# EAGLE design 12-5Convertor (EAGLE 7.2.0)
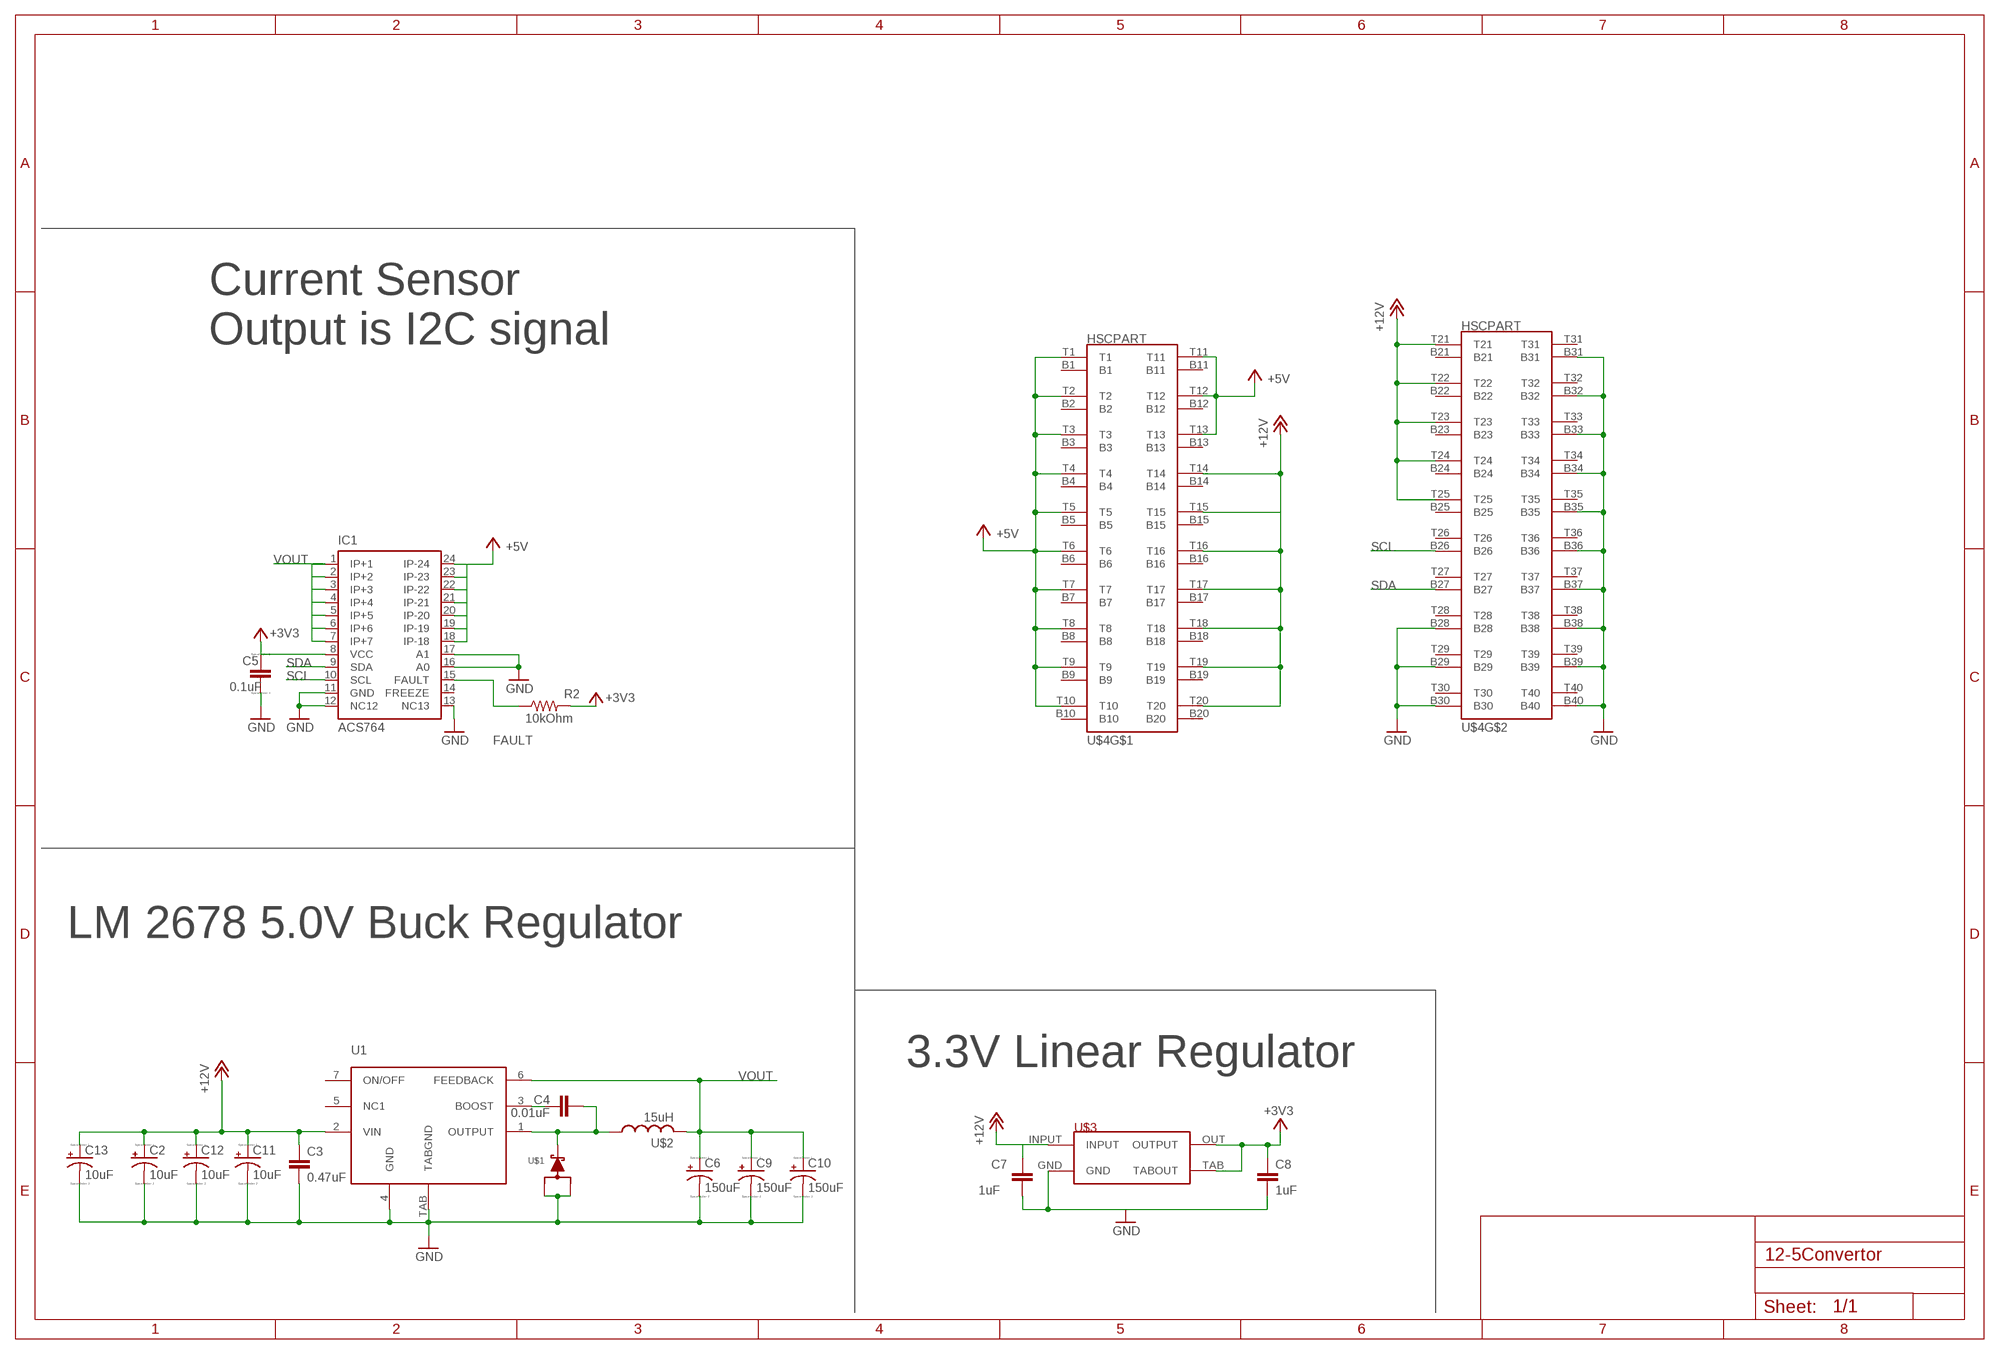
[diagram p0: schematic, sheet 1]

## Parts
C2  10uF  C-TANTALUM(10UF_150UF)  [CTAN(7.30_4.30MM)]
C3  0.47uF  CAP0805  [0805]
C4  0.01uF  CAP0603-CAP  [0603-CAP]
C5  0.1uF  CC0603  [C0603]
C6  150uF  C-TANTALUM(10UF_150UF)  [CTAN(7.30_4.30MM)]
C7  1uF  CAP0603-CAP  [0603-CAP]
C8  1uF  CAP0603-CAP  [0603-CAP]
C9  150uF  C-TANTALUM(10UF_150UF)  [CTAN(7.30_4.30MM)]
C10  150uF  C-TANTALUM(10UF_150UF)  [CTAN(7.30_4.30MM)]
C11  10uF  C-TANTALUM(10UF_150UF)  [CTAN(7.30_4.30MM)]
C12  10uF  C-TANTALUM(10UF_150UF)  [CTAN(7.30_4.30MM)]
C13  10uF  C-TANTALUM(10UF_150UF)  [CTAN(7.30_4.30MM)]
IC1  ACS764  [SSOP24]
R2  10kOhm  R-US_R0603  [R0603]
U1  LM2678  [LM2678]
U$1  SWITCHMODE_SCHOTTKY  [DPAK-3]
U$2  15uH  HCMA1305  [HCMA1305]
U$3  NCP1117  [NCP1117]
U$4  HSCPART  [HSC8-40PINOUUT]

## Nets
+3V3: C5.1 C8.1 IC1.8(VCC) R2.2 U$3.OUT(OUTPUT) U$3.TAB(TABOUT)
+5V: IC1.18(IP-18) IC1.19(IP-19) IC1.20(IP-20) IC1.21(IP-21) IC1.22(IP-22) IC1.23(IP-23) IC1.24(IP-24) U$4.T1 U$4.T2 U$4.T3 U$4.T4 U$4.T5 U$4.T6 U$4.T7 U$4.T8 U$4.T9 U$4.T10 U$4.T11 U$4.T12 U$4.T13
+12V: C2.+ C3.1 C7.1 C11.+ C12.+ C13.+ U1.2(VIN) U$3.INPUT U$4.T14 U$4.T15 U$4.T16 U$4.T17 U$4.T18 U$4.T19 U$4.T20 U$4.T21 U$4.T22 U$4.T23 U$4.T24 U$4.T25
FAULT: IC1.15(FAULT) R2.1
GND: C2.- C3.2 C5.2 C6.- C7.2 C8.2 C9.- C10.- C11.- C12.- C13.- IC1.11(GND) IC1.12(NC12) IC1.13(NC13) IC1.16(A0) IC1.17(A1) U1.4(GND) U1.TAB(TABGND) U$1.P$1 U$1.P$3 U$3.GND U$4.B28 U$4.B29 U$4.B30 U$4.B31 U$4.B32 U$4.B33 U$4.B34 U$4.B35 U$4.B36 U$4.B37 U$4.B38 U$4.B39 U$4.B40
N$2: C4.1 U1.3(BOOST)
N$3: C4.2 U1.1(OUTPUT) U$1.P$4 U$2.P$1
SCL: IC1.10(SCL) U$4.B26
SDA: IC1.9(SDA) U$4.B27
VOUT: C6.+ C9.+ C10.+ IC1.1(IP+1) IC1.2(IP+2) IC1.3(IP+3) IC1.4(IP+4) IC1.5(IP+5) IC1.6(IP+6) IC1.7(IP+7) U1.6(FEEDBACK) U$2.P$2
Unconnected: IC1.14(FREEZE) U1.5(NC1) U1.7(ON/OFF) U$4.B1 U$4.B2 U$4.B3 U$4.B4 U$4.B5 U$4.B6 U$4.B7 U$4.B8 U$4.B9 U$4.B10 U$4.B11 U$4.B12 U$4.B13 U$4.B14 U$4.B15 U$4.B16 U$4.B17 U$4.B18 U$4.B19 U$4.B20 U$4.B21 U$4.B22 U$4.B23 U$4.B24 U$4.B25 U$4.T26 U$4.T27 U$4.T28 U$4.T29 U$4.T30 U$4.T31 U$4.T32 U$4.T33 U$4.T34 U$4.T35 U$4.T36 U$4.T37 U$4.T38 U$4.T39 U$4.T40

## Notes on the sheet
- Current Sensor
  Output is I2C signal
- LM 2678 5.0V Buck Regulator
- 3.3V Linear Regulator

## Library data of the parts
C2 C6 C9-C13 = PowerComponents:C-TANTALUM(10UF_150UF)
C3 = SparkFun-Capacitors:CAP: Capacitor Standard 0603 ceramic capacitor, and 0.1" leaded capacitor.
C4 C7 C8 = SparkFun-Passives:CAP: Capacitor Standard 0603 ceramic capacitor, and 0.1" leaded capacitor.
C5 = eagle-ltspice:C: CAPACITOR, European symbol; SPICEMODEL: NONE; SPICEPREFIX: C
IC1 = ACS764:ACS764: 8-bit Microcontroller with Multiprotocol Smart Card Interface Source: Uploaded by Heiko Künzel <heiko.kuenzel@atg-gera.de> from ATG Automatisierungstechnik Gera Mon Mar 10 13:32:48 2003 Atmel-Library mit zusätzlich T83C5121-Prozessor im SSOP24-Package.; OC_FARNELL: unknown; OC_NEWARK: unknown
R2 = DiscreteComponents:R-US_: RESISTOR, American symbol
U1 = PowerComponents:LM2678: LM2678 Buck Converter IC 12V-to-5V
U$1 = PowerComponents:SWITCHMODE_SCHOTTKY: {Digi-Key Part Number: MBRD835LT4GOSCT-ND} {Voltage - DC Reverse (Vr) (Max): 35V} {Current - Average Rectified (Io): 8A} {Voltage - Forward (Vf) (Max) @ If: 510mV @ 8A} {Speed: Fast Recovery =< 500ns, > 200mA (Io)} {Current - Reverse Leakage @ Vr: 1.4mA @ 35V} {Mounting Type: Surface Mount} {Package / Case: TO-252-3, DPak (2 Leads + Tab), SC-63} {Supplier Device Package: DPAK-3} {Operating Temperature - Junction: -65°C ~ 150°C}
U$2 = DiscreteComponents:HCMA1305
U$3 = PowerComponents:NCP1117
U$4 = Connectors:HSCPART

## Board
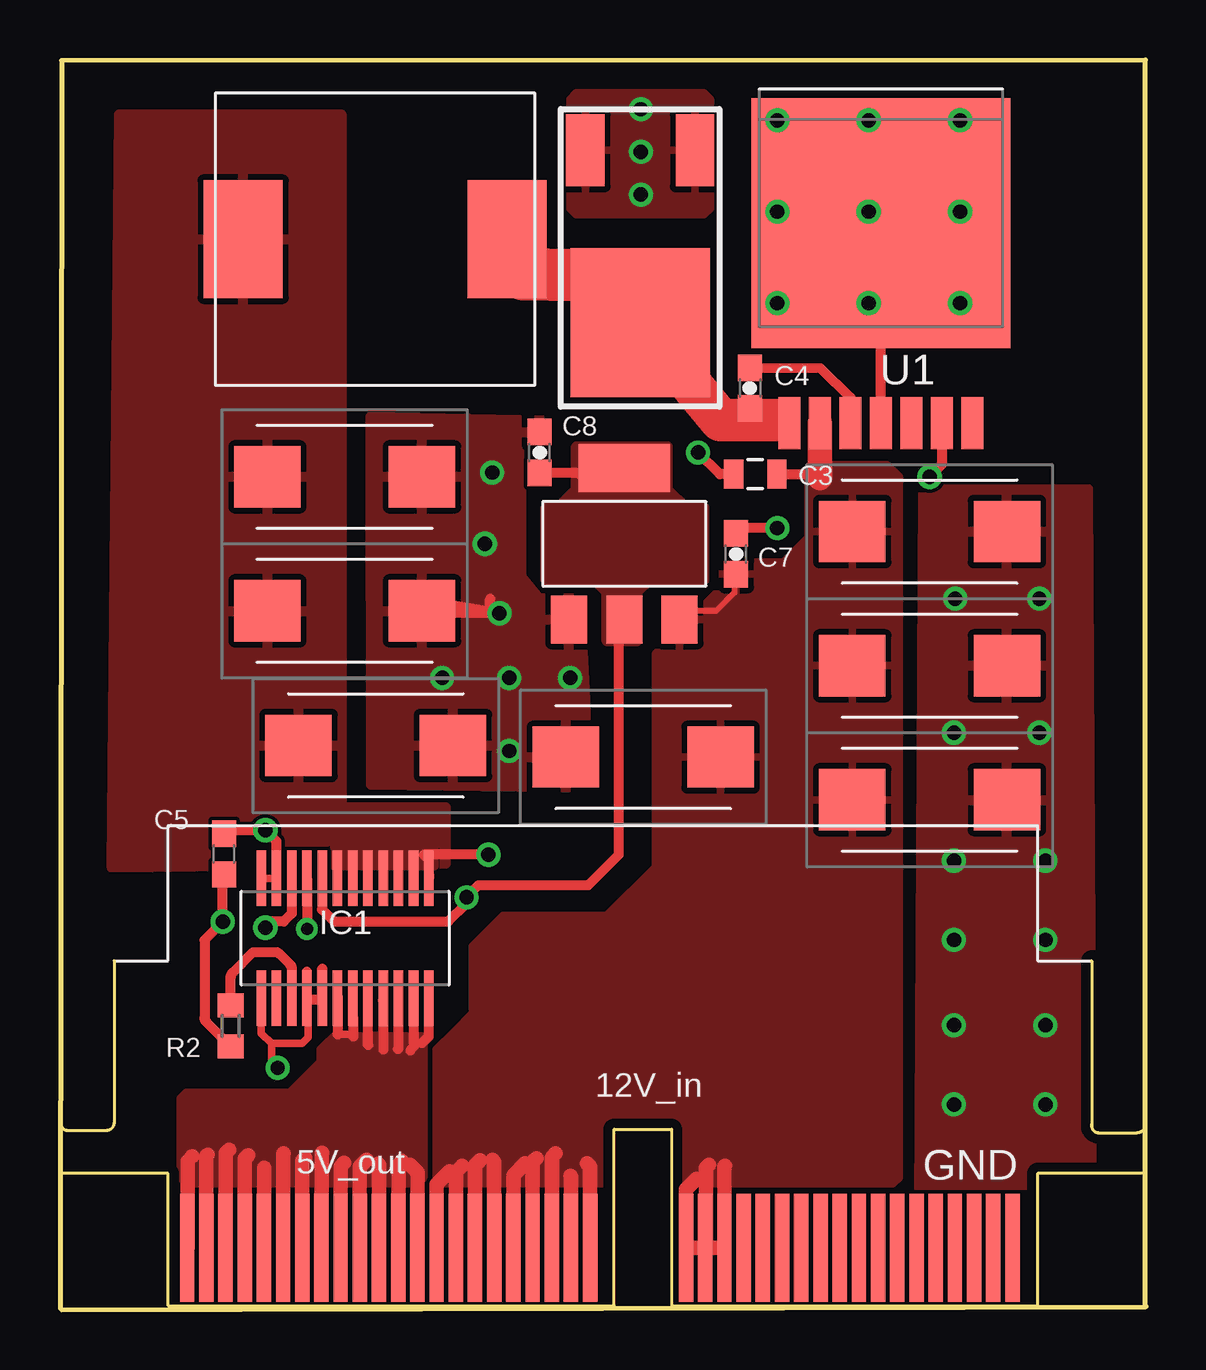
[diagram p1: board, top side]
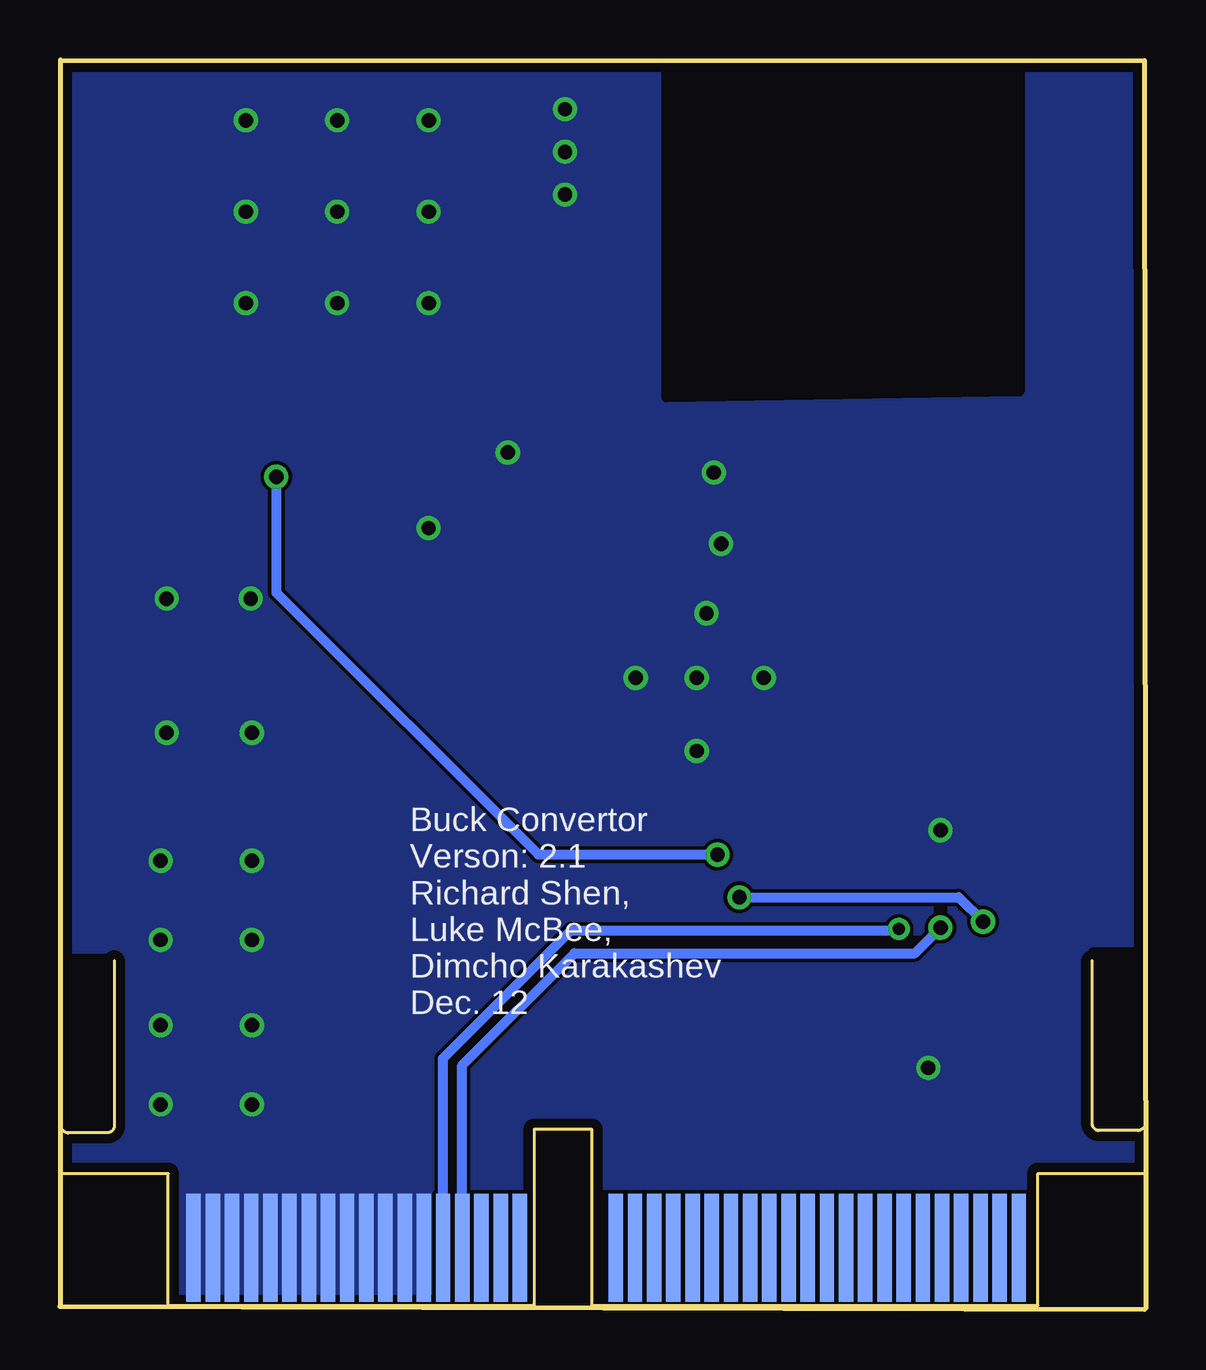
[diagram p2: board, bottom side, seen from below]

Size 45.27 x 52.09 mm. Coordinates in mm from the lower left corner, seen from the top.
Outline: 45.24,0.17 45.24,52.09 0.07,52.06 0.01,0.04
Outline: 0.05,0 45.27,0.13
Copper layers (1*16): Top 0.035559375mm / dielectric 1.501140625mm / Bottom 0.035559375mm
Design rules "typical_4pcb": minimum track width 10mil, minimum drill 15mil, track to track 6mil, track to pad 6mil, pad to pad 6mil, via to via 6mil, smd to smd 6mil, copper to edge 15mil, drill to drill 8mil, minimum pad ring 10mil, minimum via ring 8mil, stop-mask expansion 4mil, vias tented up to drill 0mil, thermal gap 10mil

### Footprints (pad centres in the part's own frame; a part is rotated, then mirrored left to right if it is on the bottom)
CTAN(7.30_4.30MM) = smd 2.77 x 2.55: + -3.22,0; - 3.22,0
0805 = smd 0.8 x 1.2: 1 -0.9,0; 2 0.9,0
0603-CAP = smd 1.1 x 1: 1 -0.85,0; 2 0.85,0
C0603 = smd 1.1 x 1: 1 -0.85,0; 2 0.85,0
SSOP24 = smd 0.4 x 2.3: 1 -3.51,-2.47; 2 -2.875,-2.47; 3 -2.24,-2.47; 4 -1.605,-2.47; 5 -0.97,-2.47; 6 -0.335,-2.47; 7 0.3,-2.47; 8 0.935,-2.47; 9 1.57,-2.47; 10 2.205,-2.47; 11 2.84,-2.47; 12 3.475,-2.47; 13 3.475,2.53; 14 2.84,2.53; 15 2.205,2.53; 16 1.57,2.53; 17 0.935,2.53; 18 0.3,2.53; 19 -0.335,2.53; 20 -0.97,2.53; 21 -1.605,2.53; 22 -2.24,2.53; 23 -2.875,2.53; 24 -3.51,2.53
R0603 = smd 1 x 1.1: 1 -0.85,0; 2 0.85,0
LM2678 = smd 2.159 x 0.914: 1 8.331,-3.81; 2 8.331,-2.54; 3 8.331,-1.27; 4 8.331,0; 5 8.331,1.27; 6 8.331,2.54; 7 8.331,3.81 | smd 10.414 x 10.795: TAB 0,0
DPAK-3 = smd 3 x 1.6: P$1 4.08,-2.285; P$3 4.08,2.285 | smd 6.2 x 5.8: P$4 -3.1,0
HCMA1305 = smd 4.9 x 3.3: P$1 0,5.5; P$2 0,-5.5
NCP1117 = smd 1.5 x 2: GND -2.3,-3.15; INPUT 2.3,-3.15; OUT 0,-3.15 | smd 3.8 x 2: TAB 0,3.15
HSC8-40PINOUUT = smd 0.6 x 4.5 bottom: B1 0.8,2.4; B2 1.6,2.4; B3 2.4,2.4; B4 3.2,2.4; B5 4,2.4; B6 4.8,2.4; B7 5.6,2.4; B8 6.4,2.4; B9 7.2,2.4; B10 8,2.4; B11 8.8,2.4; B12 9.6,2.4; B13 10.4,2.4; B14 11.2,2.4; B15 12,2.4; B16 12.8,2.4; B17 13.6,2.4; B18 14.4,2.4; B19 15.2,2.4; B20 16,2.4; B21 16.8,2.4; B22 17.6,2.4; B23 21.6,2.4; B24 22.4,2.4; B25 23.2,2.4; B26 24,2.4; B27 24.8,2.4; B28 25.6,2.4; B29 26.4,2.4; B30 27.2,2.4; B31 28,2.4; B32 28.8,2.4; B33 29.6,2.4; B34 30.4,2.4; B35 31.2,2.4; B36 32,2.4; B37 32.8,2.4; B38 33.6,2.4; B39 34.4,2.4; B40 35.2,2.4 | smd 0.6 x 4.5: T1 0.8,2.4; T2 1.6,2.4; T3 2.4,2.4; T4 3.2,2.4; T5 4,2.4; T6 4.8,2.4; T7 5.6,2.4; T8 6.4,2.4; T9 7.2,2.4; T10 8,2.4; T11 8.8,2.4; T12 9.6,2.4; T13 10.4,2.4; T14 11.2,2.4; T15 12,2.4; T16 12.8,2.4; T17 13.6,2.4; T18 14.4,2.4; T19 15.2,2.4; T20 16,2.4; T21 16.8,2.4; T22 17.6,2.4; T23 21.6,2.4; T24 22.4,2.4; T25 23.2,2.4; T26 24,2.4; T27 24.8,2.4; T28 25.6,2.4; T29 26.4,2.4; T30 27.2,2.4; T31 28,2.4; T32 28.8,2.4; T33 29.6,2.4; T34 30.4,2.4; T35 31.2,2.4; T36 32,2.4; T37 32.8,2.4; T38 33.6,2.4; T39 34.4,2.4; T40 35.2,2.4

### Placement (x,y rotation side)
C2  24.31,23.03 180 top
C3  28.99,34.82 180 top
C4  28.76,38.41 270 top
C5  6.84,18.99 90 top
C6  11.87,34.71 0 top
C7  28.18,31.5 90 top
C8  19.99,35.73 90 top
C9  11.87,29.12 0 top
C10  13.16,23.51 0 top
C11  36.25,32.43 0 top
C12  36.25,26.84 0 top
C13  36.25,21.25 0 top
IC1  11.87,15.51 180 top
R2  7.12,11.83 270 top
U1  34.22,45.28 270 top
U$1  24.18,44.24 90 top
U$2  13.14,44.62 270 top
U$3  23.52,31.92 0 top
U$4  4.5,0.17 0 top

### Tracks (layer width: path | path; a pad name or v marks a point on that pad's centre or on a via)
+3V3  (via drill 0.6)
  Top 0.406: R2.2 6.1,11.99 arc-45 6.02,12.17 6.02,15.41 v6.79,16.17 6.79,18.14 C5.1 | IC1.8 10.93,16.68 11.43,16.17 16.18,16.17 16.95,16.93 v16.95,17.19 17.45,17.69 22.03,17.69 23.3,18.96 23.3,28.54 | C8.1 21.61,34.88 22.03,34.46 22.92,34.46 U$3.TAB
  Bottom 0.406: v16.95,17.19 7.8,17.19 v6.79,16.17
  pour Top (no thermals): 22.79,27.85 22.79,29.89 22.28,30.39 20.25,30.39 20.25,33.44 20.76,33.44 21.52,34.2 21.52,35.98 25.33,35.98 25.33,34.2 26.09,33.44 26.85,33.44 26.85,30.39 24.57,30.39 24.06,29.89 24.06,27.85
+5V
  Top 0.305: 5.31,2.57 U$4.T1 | U$4.T2 | U$4.T3 | U$4.T4 | U$4.T5 | U$4.T5 | U$4.T6 | U$4.T7 | 10.92,2.56 10.9,2.55 U$4.T8 | U$4.T9 | U$4.T9 | U$4.T10 | 13.31,2.55 13.3,2.55 U$4.T11 | U$4.T12 | 14.9,2.45 U$4.T13 | 11.57,13.05 IC1.18 | 12.2,13.03 IC1.19 | IC1.20 | IC1.21 13.48,12.98 13.47,12.87 | IC1.22 | IC1.23 14.74,12.97 IC1.23 | IC1.24 15.37,12.87 | 11.57,11.47 12.2,11.47 12.21,11.4
  Top 0.406: 11.57,13.05 11.57,11.47 11.58,11.46 | 12.2,13.03 12.21,11.4 12.22,11.38 | IC1.20 12.83,11.05 12.86,11.03 | IC1.21 13.47,12.87 13.47,10.84 13.49,10.84 | IC1.22 14.1,10.88 14.08,10.85 | IC1.23 14.75,10.96 14.6,10.8 | IC1.24 15.37,12.87 15.37,11.39 15.08,11.1
  Top 0.61: 5.31,2.57 5.31,6.18 5.51,6.38 | U$4.T2 6.1,6.38 6.17,6.44 | U$4.T3 6.9,6.5 7.05,6.65 | U$4.T4 7.7,6.28 7.85,6.42 | U$4.T5 8.5,5.9 8.52,5.92 | U$4.T6 9.3,6.49 9.33,6.52 | U$4.T7 10.1,6.2 10.21,6.32 | 10.92,2.56 10.9,6.49 10.94,6.53 | U$4.T9 11.7,5.96 11.85,6.11 | U$4.T10 12.5,5.96 12.78,6.24 | 13.31,2.55 13.31,6.04 13.27,6.08 | U$4.T12 14.1,6.04 14.24,6.2 | 14.9,2.45 14.9,5.72 14.6,6.03
  pour Top: 11.61,11.6 15.42,11.6 15.42,11.34 15.17,11.09 15.17,5.5 14.91,5.25 5.26,5.25 5.01,5.5 5.01,8.8 5.26,9.06 9.58,9.06 10.85,10.33 10.85,10.84
+12V
  Top 0.254: 28.12,30.59 28.12,29.89 27.36,29.12 26.18,29.12 U$3.INPUT
  Top 0.305: U$4.T14 | 16.51,2.55 16.5,2.55 U$4.T15 | 17.3,2.54 U$4.T16 | 18.09,2.56 18.1,2.56 U$4.T17 | U$4.T18 | 19.7,2.55 U$4.T19 | 20.5,2.55 U$4.T20 | U$4.T21 | U$4.T22 22.1,2.56 U$4.T22 | 26.92,2.56 26.9,2.56 U$4.T24 | U$4.T25 27.61,2.57 27.61,2.56 | 27.7,2.56 27.61,2.56 | 27.61,2.56 27.61,2.45
  Top 0.406: C3.1 31.64,34.82 31.68,34.86 | 25.98,28.62 U$3.INPUT | 28.12,30.59 C7.1
  Top 0.61: U$4.T23 U$4.T24 U$4.T25 | U$4.T14 15.7,5.23 16.24,5.76 | 16.51,2.55 16.51,5.73 16.77,5.99 | U$4.T18 18.9,5.6 19.38,6.09 | 17.3,2.54 17.3,6.01 17.51,6.22 | 20.5,2.55 20.5,6.34 20.66,6.51 | 18.09,2.56 18.09,6.16 18.04,6.24 | 19.7,2.55 19.7,6.15 19.86,6.3 | U$4.T21 21.3,5.56 21.28,5.58 | U$4.T22 22.1,5.97 21.97,6.1 | 26.1,2.56 26.1,5.01 26.52,5.44 | 26.92,2.56 26.92,5.91 27.05,6.04 | 27.7,2.56 27.7,5.98 27.71,5.99
  Top 1.016: U1.2 31.68,34.86 31.68,34.66
  pour Top: 31.42,35.22 34.47,35.22 34.98,34.71 34.98,5.5 34.73,5.25 15.93,5.25 15.68,5.5 15.68,10.84 16.44,11.6 17.2,12.36 17.2,15.15 18.47,16.42 22.79,16.42 24.82,18.46 24.82,27.35 25.58,28.11 25.84,28.36 27.61,30.14 27.61,30.9 27.87,31.16 30.15,31.16 31.17,32.17 31.17,34.97
FAULT
  Top 0.406: R2.1 7.12,13.85 arc-45 7.19,14.03 8.06,14.9 8.97,14.9 arc-45 9.15,14.83 9.59,14.38 arc-45 9.66,14.21 IC1.15
GND  (via drill 0.6)
  Top 0.305: IC1.13 8.39,11.52 8.82,11.09 | 8.82,11.09 10.09,11.09 10.34,11.34 10.34,12.93 IC1.16 | IC1.12 IC1.11 | v9.07,10.07 8.82,10.33 8.82,11.09
  Top 0.406: IC1.16 10.3,14.09 | 10.93,14.22 IC1.17 10.89,12.93 10.34,12.93 | IC1.11 9.03,19.52 v8.56,19.98 7.15,19.98 C5.2 | C3.2 27.5,34.82 v26.6,35.73 | v29.9,32.57 28.4,32.57 C7.2 | U1.4 34.22,41.44 v33.71,41.95 | v18.32,29.02 15.27,29.53 15.27,28.89 15.09,28.89 15.09,28.95 14.79,28.95 14.79,29.3 15.14,29.3 15.14,29.05 17.94,29.05 17.94,29.63
  Top 0.61: v33.71,45.76 33.84,45.76 | 33.84,45.76 33.96,45.89 | 33.84,45.76 33.71,45.63 33.86,45.63 U1.TAB
  Top 0.813: v29.9,49.57 29.9,49.83 29.88,49.85 29.88,49.95 | 26.34,48.32 U$1.P$1 | 21.52,48.32 U$1.P$3
  other vias: 17.71,31.92 37.52,49.57 33.71,49.57 29.9,45.76 29.9,41.95 37.52,45.76 37.52,41.95 18.01,34.89 37.32,29.63 40.82,29.63 37.27,24.04 40.82,24.04 37.27,18.71 41.08,18.71 37.27,15.41 41.08,15.41 37.27,11.85 41.08,11.85 37.27,8.55 41.08,8.55 18.72,26.33 18.72,23.28 15.93,26.33 21.26,26.33 24.21,50.03 24.21,48.26 24.21,46.48
  pour Top (no thermals): 29.08,44.46 29.13,41.61 arc45 29.12,41.1 29.16,40.3 30.05,40.3 arc45 30.23,40.37 30.38,40.48 30.38,49.77 arc45 30.33,50.14 29.11,50.08
  pour Bottom (no thermals): 0,52.09 0.05,-0.11 45.29,0.22 45.19,52.11
  pour Top: 20.25,37.05 12.93,37.2 12.96,21.88 22.1,21.76 21.77,27.85 21.77,29.63 19.99,29.63 19.23,30.55 19.23,36.24 20.25,36.24
  pour Top: 36,34.2 42.85,34.2 43.01,4.21 35.82,4.23
  pour Top: 26.85,50.71 21.52,50.71 21.26,50.46 21.26,45.89 21.52,45.63 26.85,45.63 27.11,45.89 27.11,50.46
N$2
  Top 0.406: C4.1 31.7,39.24 32.95,38.01 U1.3
N$3
  Top 0.406: 29.99,37.07 U1.1 30.46,36.84 30.46,37.41 30.45,37.42 C4.2
  Top 1.422: U$2.P$1 19.31,43.16 | 22.53,43.09 U$1.P$4
  Top 1.778: U$1.P$4 27.53,37.08 29.99,37.07
  Top 2.184: 19.31,43.16 22.53,43.09
  pour Top (no thermals): 22.43,43.6 arc-45 22.61,43.53
N$5
  cutout Bottom: 2.21,14.9 0.44,14.9 0.44,14.65 2.21,14.65
  cutout Bottom: 44.89,14.65 43.11,14.65 43.11,14.39 44.89,14.39
N$8
  cutout Bottom (no thermals): 5.26,38.27 19.99,38.01 19.99,51.73 5.26,51.48
SCL  (via drill 0.6)
  Top 0.406: IC1.10 9.66,16.5 9.33,16.17 8.82,16.17 v8.56,15.92
  Bottom 0.406: U$4.B26 28.5,10.18 23.83,14.85 9.63,14.85 v8.56,15.92
SDA  (via drill 0.5)
  Top 0.406: IC1.9 v10.3,15.87
  Bottom 0.406: U$4.B27 29.3,10.47 23.96,15.81 10.35,15.81 v10.3,15.87
VOUT  (via drill 0.6)
  Top 0.254: 15.17,18.96 15.17,18.83 15.4,18.6 15.4,18 IC1.1
  Top 0.406: 15.38,18.16 IC1.1 | U1.6 36.76,35.22 v36.25,34.71 | v17.86,18.96 15.17,18.96
  Bottom 0.406: v36.25,34.71 36.25,29.89 25.33,18.96 v17.86,18.96
  pour Top (no thermals): 11.36,18.46 15.68,18.46 15.68,19.98 11.36,19.98
  pour Top: 2.47,49.82 11.74,49.82 11.74,20.95 16.08,20.95 16.08,18.58 2.16,18.41

### Text on the board
tPlace: 12V_in | 5V_out | GND
bPlace: Buck Convertor / Verson: 2.1 / Richard Shen, / Luke McBee, / Dimcho Karakashev / Dec. 12